# EAGLE board powerSwitch009 (EAGLE 5.12)
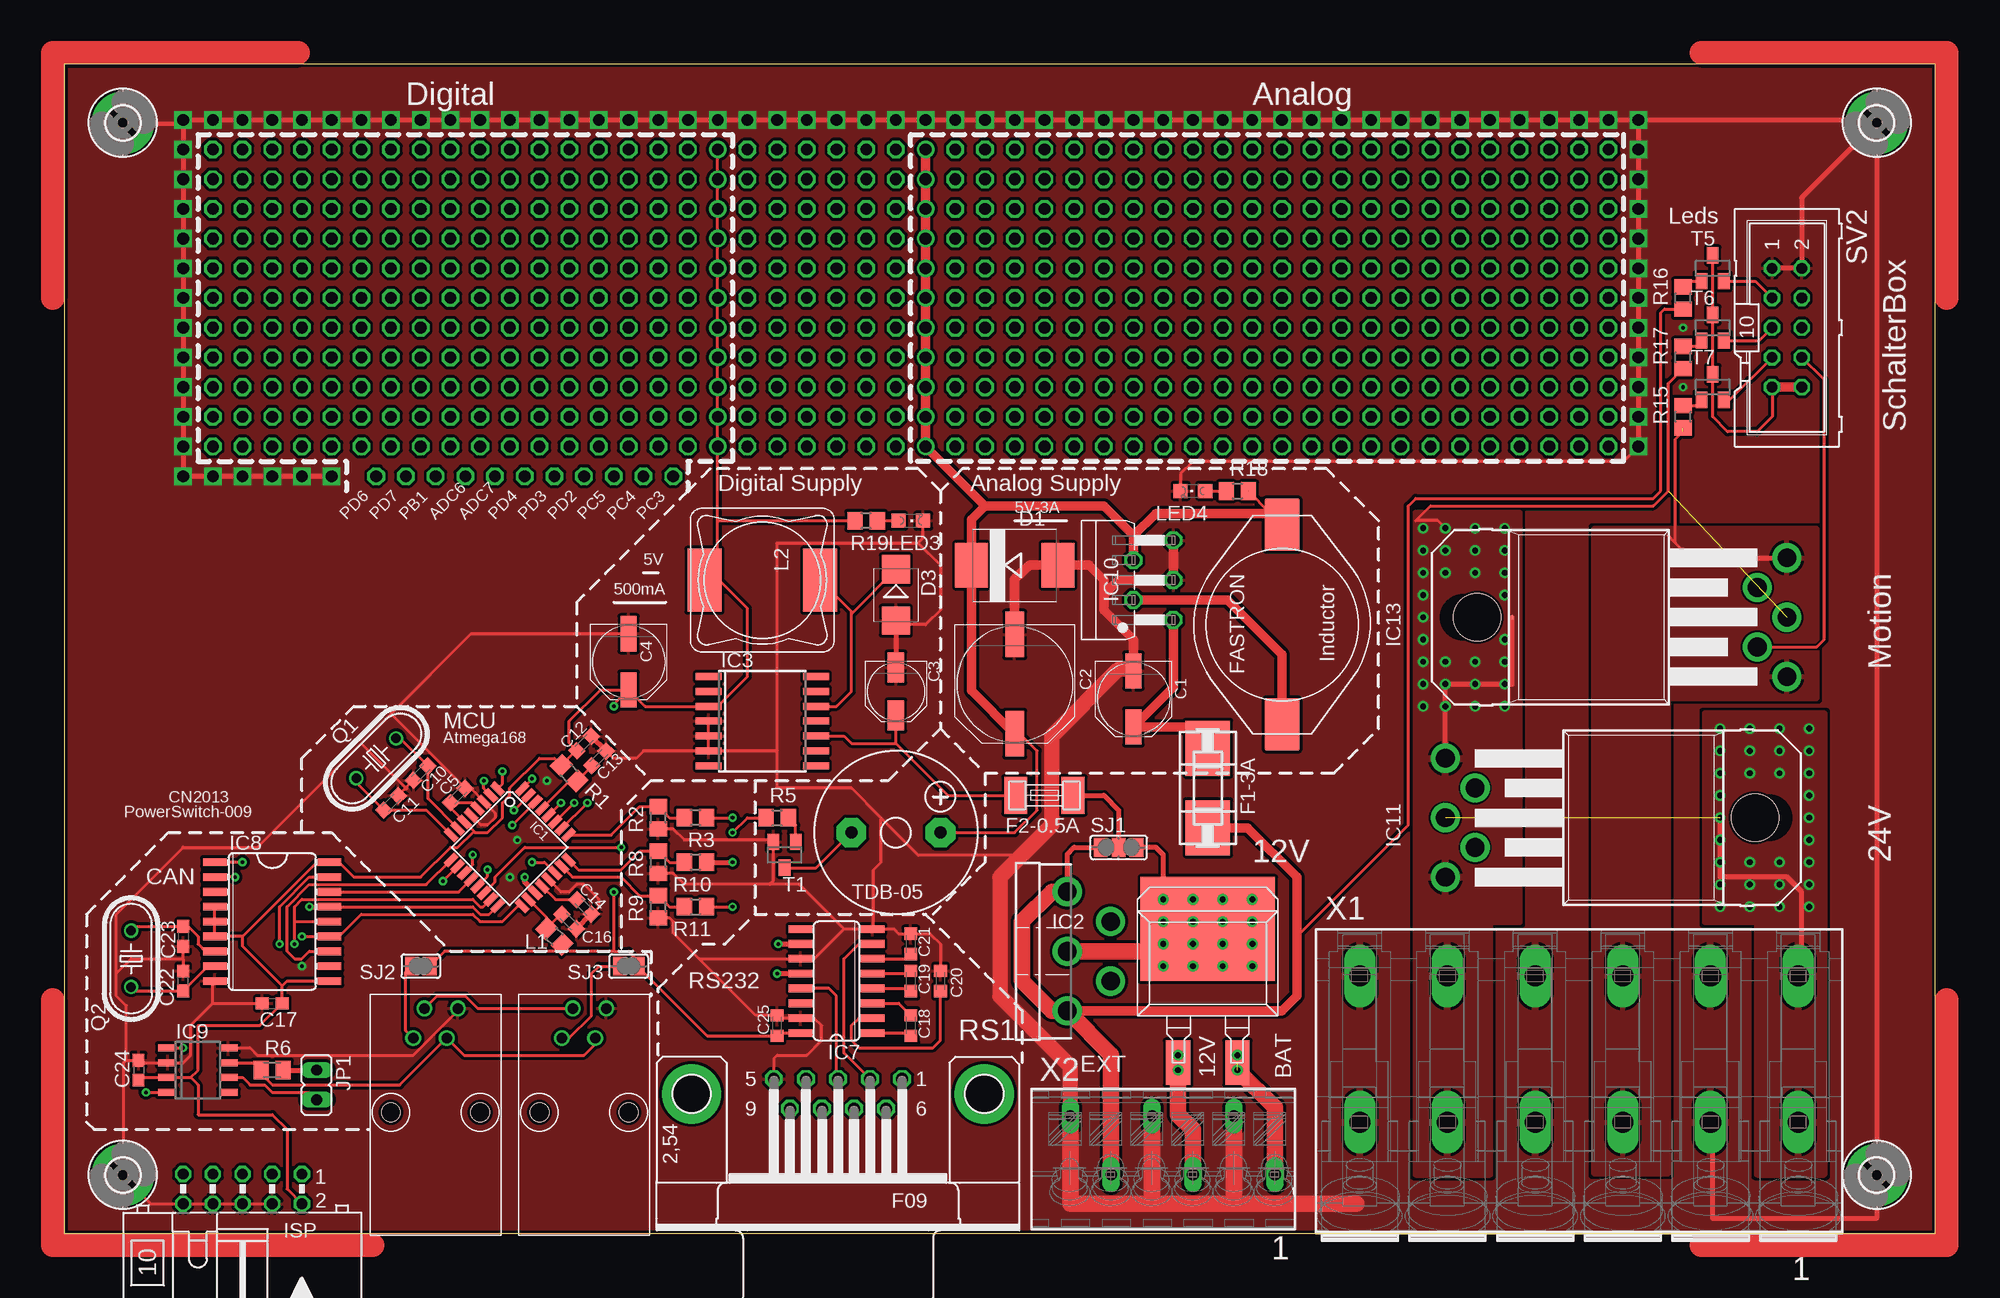
[diagram p2: board, top side]
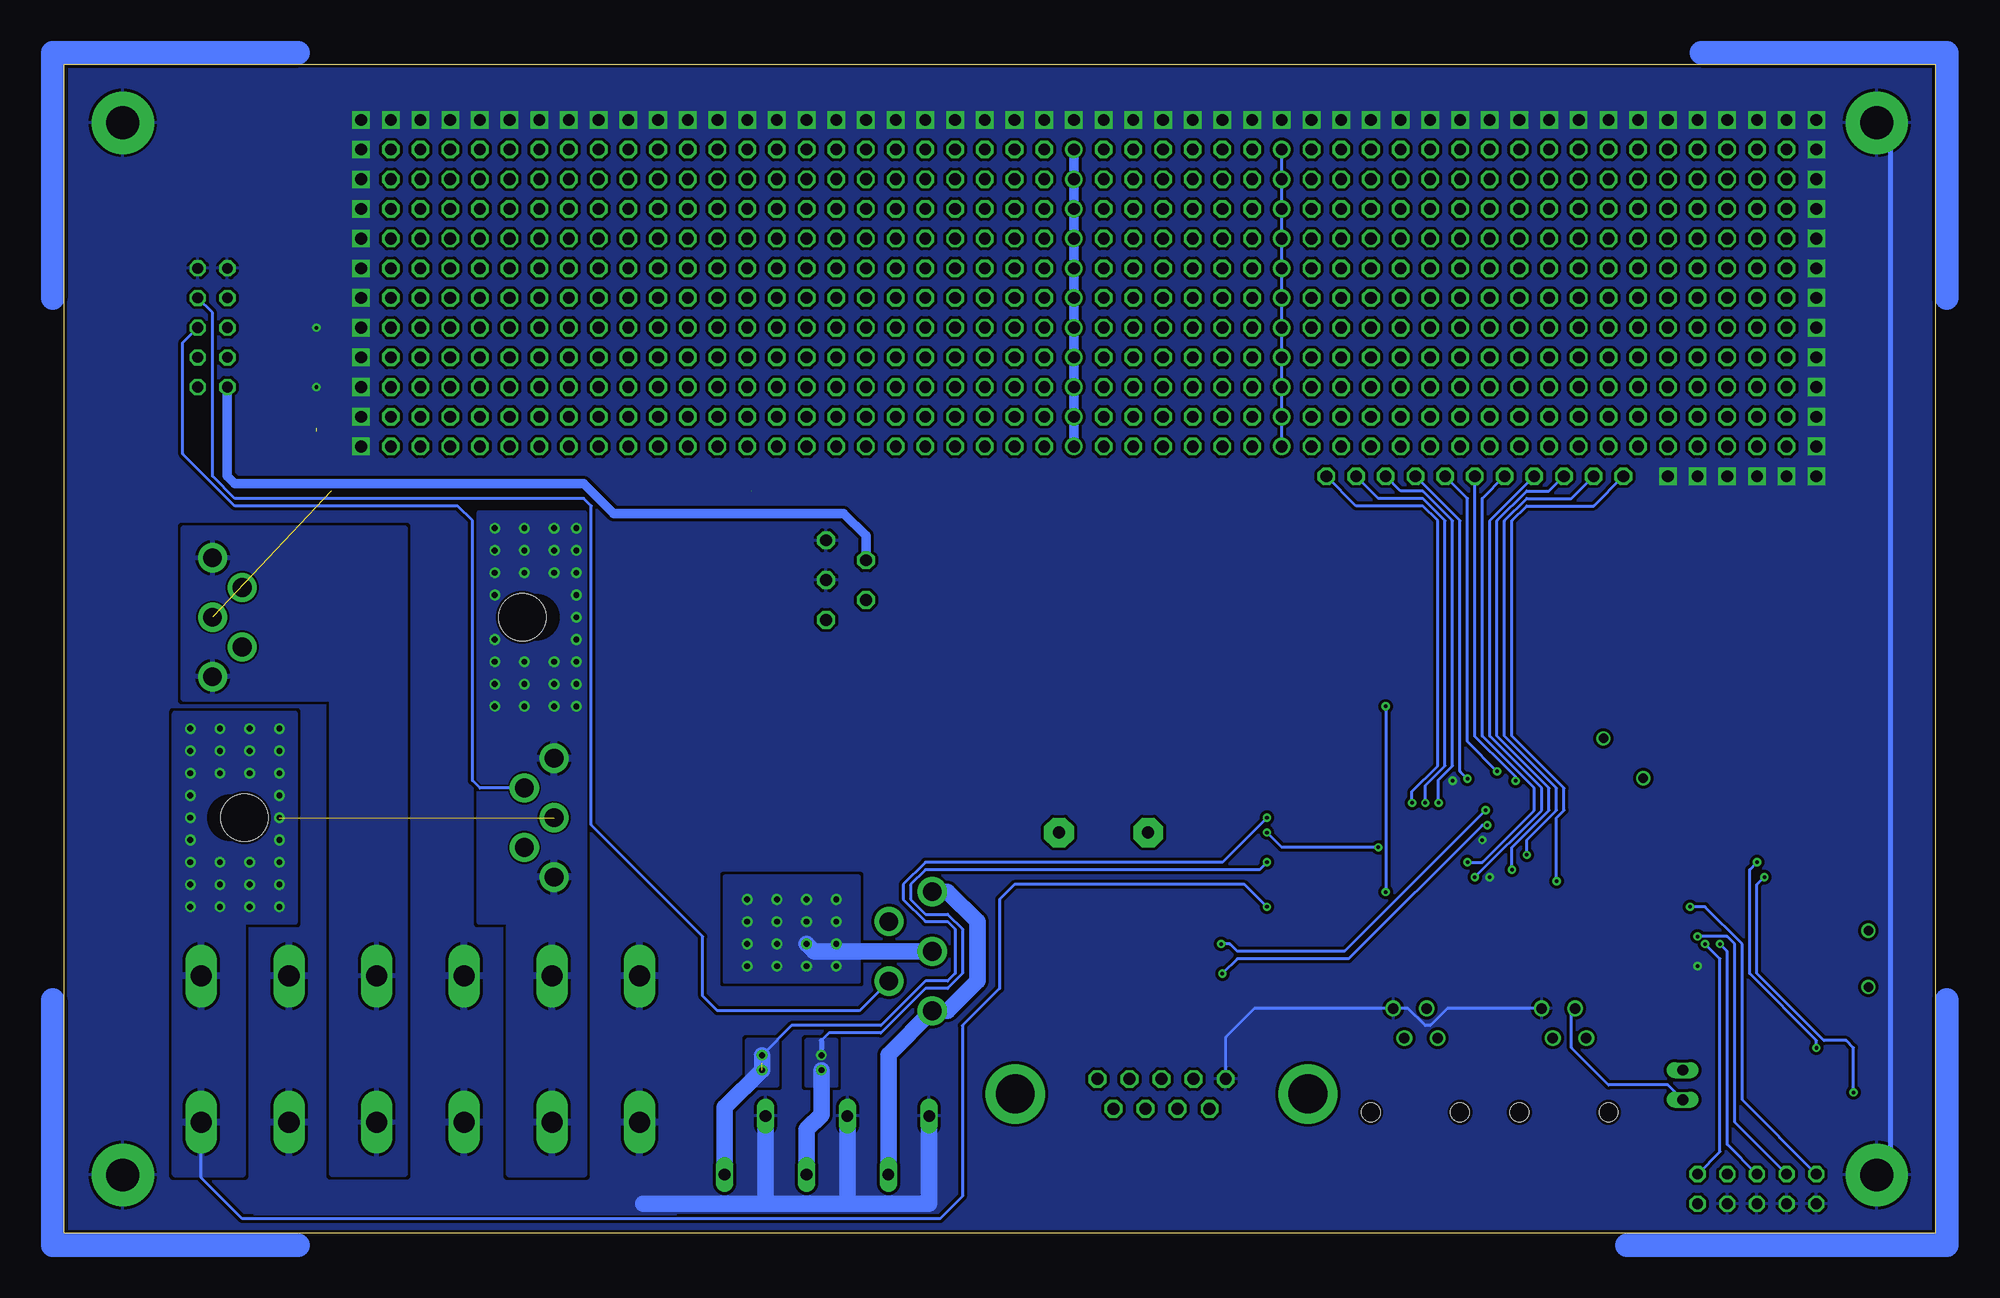
[diagram p3: board, bottom side, seen from below]

Size 160 x 100 mm. Coordinates in mm from the lower left corner, seen from the top.
Outline: 0,0 160,0 160,100 0,100 0,0
Copper layers (1+2*15+16): Top 0.035mm / dielectric 0.36mm / Route2 0.018mm / dielectric 0.71mm / Route15 0.018mm / dielectric 0.36mm / Bottom 0.035mm
Design rules "qp_designrules_6mil *": minimum track width 6mil, minimum drill 0.3mm, track to track 6mil, track to pad 6mil, pad to pad 6mil, via to via 6mil, smd to smd 6mil, copper to edge 8mil, drill to drill 10mil, minimum pad ring 8mil, minimum via ring 8mil, stop-mask expansion 4mil, vias tented up to drill 16mil, thermal gap 10mil

## Footprints (pad centres in the part's own frame; a part is rotated, then mirrored left to right if it is on the bottom)
PANASONIC_D = smd 3 x 1.4: + 2.4,0; - -2.4,0
PANASONIC_G = smd 3.9 x 1.6: + 4.25,0; - -4.25,0
PANASONIC_C = smd 2.6 x 1.4: + 2.05,0; - -2.05,0
C0603K = smd 1.05 x 1.08: 1 -0.875,0; 2 0.875,0
C0603 = smd 1.1 x 1: 1 -0.85,0; 2 0.85,0
SMC = smd 2.8 x 3.8: A 3.7,0; C -3.7,0
D2PAK = smd 2.08 x 3.81: P$1 -2.54,-6.985; P$2 2.54,-6.985 | smd 11.5 x 8.89: P$3 0,4.445
SMB = smd 2.4 x 2.4: A 2.2,0; C -2.2,0
OMNIBLOK = smd 4.7 x 3.8: P$1 -3.4,0; P$2 3.4,0
SMD-6,1X2,6 = smd 1.96 x 3.15: 1 -2.45,0; 2 2.45,0
2,8-PAD = drill 2.8 pad 5.334 round: B2,8 0,0
TQFP32-08 = smd 1.27 x 0.559: 1 -4.293,2.8; 2 -4.293,2; 3 -4.293,1.2; 4 -4.293,0.4; 5 -4.293,-0.4; 6 -4.293,-1.2; 7 -4.293,-2; 8 -4.293,-2.8; 17 4.293,-2.8; 18 4.293,-2; 19 4.293,-1.2; 20 4.293,-0.4; 21 4.293,0.4; 22 4.293,1.2; 23 4.293,2; 24 4.293,2.8 | smd 0.559 x 1.27: 9 -2.8,-4.293; 10 -2,-4.293; 11 -1.2,-4.293; 12 -0.4,-4.293; 13 0.4,-4.293; 14 1.2,-4.293; 15 2,-4.293; 16 2.8,-4.293; 25 2.8,4.293; 26 2,4.293; 27 1.2,4.293; 28 0.4,4.293; 29 -0.4,4.293; 30 -1.2,4.293; 31 -2,4.293; 32 -2.8,4.293
TO220-51 = drill 1.6 pad 2.5 round: 1 -5.1,-4.5; 2 -2.55,-8.2; 3 0,-4.5; 4 2.55,-8.2; 5 5.1,-4.5
SO14W = smd 0.6 x 2.2: 1 -3.81,-4.6; 2 -2.54,-4.6; 3 -1.27,-4.6; 4 0,-4.6; 5 1.27,-4.6; 6 2.54,-4.6; 7 3.81,-4.6; 8 3.81,4.6; 9 2.54,4.6; 10 1.27,4.6; 11 0,4.6; 12 -1.27,4.6; 13 -2.54,4.6; 14 -3.81,4.6
SO16 = smd 0.66 x 2.032: 1 -4.445,-3.073; 2 -3.175,-3.073; 3 -1.905,-3.073; 4 -0.635,-3.073; 5 0.635,-3.073; 6 1.905,-3.073; 7 3.175,-3.073; 8 4.445,-3.073; 9 4.445,3.073; 10 3.175,3.073; 11 1.905,3.073; 12 0.635,3.073; 13 -0.635,3.073; 14 -1.905,3.073; 15 -3.175,3.073; 16 -4.445,3.073
SO18L = smd 0.66 x 2.032: 1 -5.08,-4.902; 2 -3.81,-4.902; 3 -2.54,-4.902; 4 -1.27,-4.902; 5 0,-4.902; 6 1.27,-4.902; 7 2.54,-4.902; 8 3.81,-4.902; 9 5.08,-4.902; 10 5.08,4.902; 11 3.81,4.902; 12 2.54,4.902; 13 1.27,4.902; 14 0,4.902; 15 -1.27,4.902; 16 -2.54,4.902; 17 -3.81,4.902; 18 -5.08,4.902
SO8 = smd 0.6 x 1.6: 1 -1.905,-2.6; 2 -0.635,-2.6; 3 0.635,-2.6; 4 1.905,-2.6; 5 1.905,2.6; 6 0.635,2.6; 7 -0.635,2.6; 8 -1.905,2.6
TO220-5_STAGGERED = drill 1.016 octagon: !EN 3.404,-3.404; FB 1.702,0; GND 0,-3.404; IN -3.404,-3.404; OUT -1.702,0
TO220-52 = drill 1.6 pad 2.5 round: 1 -5.08,-30.48; 2 -2.54,-27.94; 3 0,-30.48; 4 2.54,-27.94; 5 5.08,-30.48 | smd 0.305 x 0.152: 6 0,-6.985 | hole 4.05: 0,-4
ML10L = drill 0.914 octagon: 1 -5.08,-1.27; 2 -5.08,1.27; 3 -2.54,-1.27; 4 -2.54,1.27; 5 0,-1.27; 6 0,1.27; 7 2.54,-1.27; 8 2.54,1.27; 9 5.08,-1.27; 10 5.08,1.27
JP1 = drill 0.914 long: 1 0,-1.27; 2 0,1.27
R0805 = smd 1.3 x 1.5: 1 -0.95,0; 2 0.95,0
PIS4728 = smd 5.4 x 2.9: P$1 0,4.95; P$2 0,-4.95
PISR = smd 4.5 x 3: P$1 -8.55,0; P$2 8.55,0
CHIPLED_0805 = smd 1.2 x 1.2: A 0,-1.05; C 0,1.05
HC49U-V = drill 0.813 round: 1 -2.413,0; 2 2.413,0
M0805 = smd 1.3 x 1.6: 1 -0.95,0; 2 0.95,0
RJ10 = drill 0.9 round: P$1 -1.905,6.55; P$2 -0.953,9.09; P$3 0.953,6.55; P$4 1.905,9.09 | hole 1.59: -3.81,0.2; 3.81,0.2
F09HP = drill 1.016 octagon: 1 -5.486,-1.27; 2 -2.743,-1.27; 3 0,-1.27; 4 2.743,-1.27; 5 5.486,-1.27; 6 -4.115,1.27; 7 -1.372,1.27; 8 1.372,1.27; 9 4.115,1.27 | drill 3.302 pad 5.08 round: G1 -12.522,0; G2 12.522,0
SJ_2 = smd 1.168 x 1.6: 1 -1.524,0; 2 0,0; 3 1.524,0
SJ = smd 1.168 x 1.6: 1 -0.762,0; 2 0.762,0
ML10 = drill 0.914 octagon: 1 -5.08,-1.27; 2 -5.08,1.27; 3 -2.54,-1.27; 4 -2.54,1.27; 5 0,-1.27; 6 0,1.27; 7 2.54,-1.27; 8 2.54,1.27; 9 5.08,-1.27; 10 5.08,1.27
SOT23 = smd 1 x 1.4: 1 -0.95,-1.1; 2 0.95,-1.1; 3 0,1.1
F/CM12P = drill 1.016 pad 2.54 octagon: + 3.81,0; - -3.81,0
P-2706-106 = drill 1.8 long: L1.1 3.185,18.75; L1.2 -9.315,18.75; L2.1 3.185,11.25; L2.2 -9.315,11.25; L3.1 3.185,3.75; L3.2 -9.315,3.75; L4.1 3.185,-3.75; L4.2 -9.315,-3.75; L5.1 3.185,-11.25; L5.2 -9.315,-11.25; L6.1 3.185,-18.75; L6.2 -9.315,-18.75
P-250-206 = drill 1 long: L1 1.3,9.55; L2 -3.7,6.05; L3 1.3,2.55; L4 -3.7,-0.95; L5 1.3,-4.45; L6 -3.7,-7.95

## Placement (x,y rotation side)
C1  100 µF  [PANASONIC_D]  91.44,45.72 270 top
C2  1000 µF  [PANASONIC_G]  81.28,46.99 270 top
C3  VF 22/35 P-C  [PANASONIC_C]  71.12,46.35 270 top
C4  VF 220/16 K-D8  [PANASONIC_D]  48.26,48.9 270 top
C5  100n  [C0603K]  33.66,37.47 45 top
C10  22p  [C0603K]  30.48,39.37 45 top
C11  22p  [C0603K]  27.94,36.83 225 top
C12  100n  [C0603K]  44.45,41.91 225 top
C13  100n  [C0603K]  45.72,40.64 225 top
C14  100n  [C0603K]  44.45,27.94 135 top
C16  100n  [C0603K]  43.18,26.67 315 top
C17  100n  [C0603]  17.78,19.68 0 top
C18  100n  [C0603K]  72.39,17.78 270 top
C19  100n  [C0603K]  72.39,21.59 270 top
C20  100n  [C0603K]  74.93,21.59 90 top
C21  100n  [C0603K]  72.39,24.77 90 top
C22  22p  [C0603]  10.16,21.59 90 top
C23  22p  [C0603]  10.16,25.4 270 top
C24  100n  [C0603]  6.35,13.97 270 top
C25  100n  [C0603K]  60.96,17.78 90 top
D1  MBRS360  [SMC]  81.28,57.15 0 top
D2  SFS1602G  [D2PAK]  97.79,21.59 0 top
D3  MBRS140  [SMB]  71.12,54.61 270 top
F1-3A  SMD-MICRO-FUSE-BLOCK  [OMNIBLOK]  97.79,38.1 90 top
F2-0.5A  SMD-MICRO-FUSE  [SMD-6,1X2,6]  83.82,37.47 180 top
H5  MOUNT-PAD-ROUND2.8  [2,8-PAD]  5,95 0 top
H6  MOUNT-PAD-ROUND2.8  [2,8-PAD]  155,95 0 top
H7  MOUNT-PAD-ROUND2.8  [2,8-PAD]  5,5 0 top
H8  MOUNT-PAD-ROUND2.8  [2,8-PAD]  155,5 0 top
IC1  MEGA168  [TQFP32-08]  38.1,33.02 315 top
IC2  BTS555  [TO220-51]  81.28,24.13 90 top
IC3  LM2574M-5.0  [SO14W]  59.69,43.81 270 top
IC7  MAX202  [SO16]  66.04,21.59 90 top
IC8  MCP2515-E/SO  [SO18L]  17.78,26.67 270 top
IC9  PCA82C250T  [SO8]  11.43,13.97 270 top
IC10  LM2576-5  [TO220-5_STAGGERED]  91.44,55.88 90 top
IC11  BTS555E3146  [TO220-52]  148.59,35.56 270 top
IC13  BTS555E3146  [TO220-52]  116.84,52.7 90 top
ISP  socket  [ML10L]  15.24,3.81 180 top
JP1  [JP1]  21.59,12.7 180 top
L1  10µH  [R0805]  41.91,25.4 315 top
L2  L-PIS4728  [PIS4728]  59.69,55.88 270 top
L-PISR  100 µH  [PISR]  104.14,52.07 90 top
LED3  [CHIPLED_0805]  72.39,60.96 270 top
LED4  [CHIPLED_0805]  96.52,63.5 90 top
Q1  20Mhz  [HC49U-V]  26.67,40.64 45 top
Q2  16MHz  [HC49U-V]  5.71,23.5 270 top
R1  10k  [R0805]  43.18,39.37 135 top
R2  20k  [R0805]  50.8,35.56 90 top
R3  100k  [R0805]  53.98,35.56 180 top
R5  4k7  [R0805]  60.96,35.56 0 top
R6  [M0805]  17.78,13.97 0 top
R8  20k  [R0805]  50.8,31.75 90 top
R9  20k  [R0805]  50.8,27.94 90 top
R10  100k  [R0805]  53.98,31.75 180 top
R11  100k  [R0805]  53.98,27.94 0 top
R15  20k  [R0805]  138.43,69.85 90 top
R16  10k  [R0805]  138.43,80.01 90 top
R17  20k  [R0805]  138.43,74.93 90 top
R18  150  [R0805]  100.33,63.5 0 top
R19  150  [R0805]  68.58,60.96 180 top
RJ_1  RJ10  [RJ10]  44.45,10.16 0 top
RJ_2  RJ10  [RJ10]  31.75,10.16 0 top
RS1  socket  [F09HP]  66.17,11.94 180 top
SJ1  [SJ_2]  90.17,33.02 0 top
SJ2  [SJ]  30.48,22.86 180 top
SJ3  [SJ]  48.26,22.86 180 top
SV2  SchalterBox  [ML10]  147.32,77.47 270 top
T1  BC847  [SOT23]  61.59,32.38 180 top
T5  BC849  [SOT23]  140.97,82.55 0 top
T6  BC849  [SOT23]  140.97,77.47 0 top
T7  BC849  [SOT23]  140.97,72.39 0 top
TDB-05  F/CM12P  [F/CM12P]  71.12,34.29 0 top
X1  2706-106  [P-2706-106]  129.54,12.7 270 top
X2  250-206  [P-250-206]  93.98,6.35 270 top

## Tracks (layer width: path | path; a pad name or v marks a point on that pad's centre or on a via)
+5V  (via drill 1)  (1 unrouted)
  Top 0.254: SV2.9 146.05,69.85 144.78,68.58 142.24,68.58 140.97,69.85 T7.3 T6.3 T5.3 | TDB-05.+ 81.28,34.29 83.19,36.2 83.19,41.27 81.72,42.74 C2.+ | 103.17,61.59 101.26,63.5
  Top 0.813: SV2.9 SV2.10 | 91.44,59.69 93.34,61.59 103.17,61.59 L-PISR.P$2 | 78.74,62.23 v73.66,67.31 v73.66,69.85 v73.66,72.39 v73.66,74.93 v73.66,77.47 v73.66,80.01 v73.66,82.55 v73.66,85.09 v73.66,87.63 v73.66,90.17 v73.66,92.71 | 91.44,59.69 IC10.FB | 91.44,59.69 88.9,62.23 78.74,62.23 | 78.74,62.23 77.58,61.07 D1.C 77.58,46.44 C2.+
  Bottom 0.813: IC10.FB 91.44,59.69 93.34,61.59 113.03,61.59 115.57,64.14 145.41,64.14 146.05,64.77 SV2.9 | v73.66,67.31 v73.66,69.85 v73.66,72.39 v73.66,74.93 v73.66,77.47 v73.66,80.01 v73.66,82.55 v73.66,85.09 v73.66,87.63 v73.66,90.17 v73.66,92.71
ADC0
  Top 0.254: R11.1 51.75,27.94 R9.2 49.22,28.89 47.62,30.48 43.47,30.48 IC1.23
ADC1
  Top 0.254: R10.2 51.75,31.75 R8.2 49.21,32.7 47.62,31.11 43.97,31.11 IC1.24
ADC2
  Top 0.254: R3.2 51.75,35.56 R2.2 49.21,36.51 46.77,34.08 IC1.25
ADC6  (via drill 0.3, 1)
  Top 0.406: IC1.19 39.37,30.05 v39.37,30.48
  Bottom 0.254: v39.37,30.48 33.66,36.2 33.66,38.1 38.1,42.55 38.1,60.96 v34.29,64.77
ADC7  (via drill 0.3, 1)
  Top 0.254: IC1.22 41.07,31.75 v40.01,31.75
  Bottom 0.254: v40.01,31.75 38.73,31.75 34.29,36.2 34.29,38.1 38.73,42.55 38.73,62.87 v36.83,64.77
BAT12V  (via drill 0.3, 0.5)  (1 unrouted)
  Top 0.254: R3.1 v57.15,35.56
  Top 1.422: X2.L1 103.53,10.77 v100.33,13.97 v100.33,15.24
  Bottom 0.254: v100.33,15.24 97.79,17.78 90.17,17.78 86.36,21.59 84.45,21.59 83.82,22.23 83.82,26.04 84.45,26.67 86.36,26.67 88.27,28.57 88.27,29.84 86.36,31.75 60.96,31.75 v57.15,35.56
  Bottom 1.422: v100.33,15.24 v100.33,13.97 103.53,10.77 X2.L1
  pour Bottom: 99.06,16.51 101.6,16.51 101.6,12.7 99.06,12.7
BAT24V  (via drill 0.3, 0.5)  (1 unrouted)
  Top 0.254: R11.2 v57.15,27.94
  Top 0.406: X1.L1.2 148.59,22.32 148.59,29.21 147.32,30.48 141.6,30.48 IC11.6
  Bottom 0.254: v57.15,27.94 59.05,29.84 78.74,29.84 80.01,28.57 80.01,20.95 83.19,17.78 83.19,3.17 85.09,1.27 144.78,1.27 148.29,4.78 X1.L1.1
  other vias: 149.22,41.27 149.22,39.37 149.22,37.47 149.22,35.56 149.22,43.18 146.69,43.18 144.15,43.18 141.6,43.18 146.69,39.37 149.22,31.75 149.22,27.94 146.69,27.94 144.15,27.94 141.6,27.94 141.6,31.75 141.6,35.56 141.6,39.37 144.15,39.37 141.6,41.27 144.15,41.27 146.69,41.27 146.69,29.84 144.15,29.84 141.6,29.84 144.15,31.75 146.69,31.75 149.22,29.84 149.22,33.66 141.6,33.66 141.6,37.47
  pour Top: 150.5,44.45 140.34,44.45 140.34,26.67 144.78,26.67 144.78,5.08 150.5,5.08
  pour Bottom: 150.5,44.45 140.34,44.45 140.34,26.67 144.78,26.67 144.78,5.08 150.5,5.08
CANH
  Top 0.254: IC9.7 16.2,14.61 R6.1 | RJ_1.P$3 45.4,16.19 44.45,15.24 34.17,15.24 RJ_2.P$3 28.69,12.7 17.78,12.7 16.83,13.65
  Top 0.406: R6.1 16.83,13.65
CANL
  Top 0.254: RJ_1.P$2 35.36,19.25 34.29,20.32 31.87,20.32 RJ_2.P$2 | JP1.2 20.95,12.06 17.78,12.06 17.14,12.7 15.88,12.7 15.24,13.34 IC9.6
  Bottom 0.254: JP1.2 22.86,12.7 27.94,12.7 31.11,15.88 31.11,18.93 RJ_2.P$2
CS
  Top 0.254: IC8.16 33.72,29.21 IC1.12
EXT  (via drill 0.3, 0.5)
  Top 0.406: R10.1 v57.15,31.75
  Top 1.422: X2.L3 96.53,8.9 95.25,10.16 v95.25,13.97 D2.P$1
  Bottom 0.254: v57.15,31.75 57.78,31.11 86.36,31.11 87.63,29.84 87.63,28.57 86.36,27.3 84.45,27.3 83.19,26.04 83.19,22.23 84.45,20.95 86.36,20.95 90.17,17.14 94.61,17.14 95.25,16.51
  Bottom 0.406: 95.25,16.51 v95.25,15.24
  Bottom 1.422: v95.25,13.97 95.25,10.16 96.53,8.9 X2.L3
  pour Bottom: 93.98,16.51 96.52,16.51 96.52,12.7 93.98,12.7
GND  (via drill 0.3, 1)
  Top 0.254: 6.57,14.61 IC9.2 10.16,14.61 10.79,15.24 10.79,17.78 12.7,19.68 | ISP.4 ISP.6 ISP.8 ISP.10 7.41,2.54 H7.B2,8 | 29.21,38.1 C11.1 | 29.21,38.1 C10.1 | 61.2,18.41 IC7.15 64.14,18.41 64.77,17.78 64.77,16.51 63.5,15.24 60.96,15.24 60.68,14.96 RS1.5 | C20.2 74.93,24.77 74.06,25.64 C21.2 71.36,25.64 70.97,26.04 69.22,26.04 69.22,31.11 69.85,31.75 69.85,35.56 | IC3.4 IC3.5 IC3.6 | 66.67,26.04 64.14,23.5 IC7.11 54.3,23.5 | 66.67,26.04 IC7.8 | 34.73,38.08 IC1.3 36.83,35.99 36.83,35.56 36.2,34.92 35.63,34.92 IC1.5 | 10.16,23.5 C22.2 | 10.16,23.5 C23.2 | 4.45,22.23 4.45,20.32 5.29,19.47 5.29,14.82 | 4.45,22.23 5.71,23.5 10.16,23.5 | RJ_2.P$4 33.66,19.05 29.84,15.24 16.51,15.24 15.88,15.88 IC9.8 | 27.94,44.45 34.78,51.3 C4.- | 60.33,29.84 62.87,29.84 66.67,26.04 | 60.33,29.84 53.02,29.84 52.07,30.8 R8.1 | 60.33,29.84 60.65,30.16 T1.2 60.18,33.66 53.02,33.66 52.07,34.61 R2.1 | 69.85,35.56 67.31,38.1 60.96,38.1 60.96,41.27 | 60.96,41.27 60.96,59.05 73.03,59.05 | IC8.9 12.88,21.41 | 27.94,44.45 34.29,38.1 | 71.46,52.07 73.66,52.07 74.93,53.34 74.93,57.15 73.03,59.05 | R9.1 51.75,26.99 52.07,26.67 52.07,25.72 54.3,23.5 | H7.B2,8 5,5.16 | 5.29,14.82 C24.1 | 5.29,14.82 5.08,14.61 5.08,5.08 H7.B2,8 | 12.7,19.68 C17.1 | 12.7,19.68 12.7,21.41 | IC3.6 49.53,41.27 48.9,40.64 46.96,40.64 C13.1 | IC1.21 42.48,29.21 43.18,29.21 43.81,29.84 44.45,29.84 45.72,28.57 45.72,27.94 45.1,27.32 | 25.4,41.91 16.51,33.02 10.16,33.02 4.45,27.3 4.45,22.23 | 25.4,41.91 27.94,44.45 | 25.4,41.91 29.21,38.1 | v134.62,67.31 133.35,66.04 96.52,66.04 95.47,64.99 LED4.C | 81.92,32.38 73.03,32.38 69.85,35.56 | 60.96,41.27 IC3.6 | 54.3,23.5 59.13,18.66 C25.2
  Top 0.254: LED3.C 73.44,59.47 73.03,59.05
  Top 0.406: C24.1 6.57,14.61 | SV2.1 SV2.2 148.59,88.59 H6.B2,8 | 86,7.62 86,10 | H5.B2,8 10.16,94.94 | 61.2,18.41 C25.2 | 10.16,94.94 v10.16,92.71 v10.16,90.17 v10.16,87.63 v10.16,85.09 v10.16,82.55 v10.16,80.01 v10.16,77.47 v10.16,74.93 v10.16,72.39 v10.16,69.85 v10.16,67.31 v10.16,64.77 v12.7,64.77 v15.24,64.77 v17.78,64.77 v20.32,64.77 v22.86,64.77 | 10.16,94.94 v10.16,95.25 v12.7,95.25 v15.24,95.25 v17.78,95.25 v20.32,95.25 v22.86,95.25 v25.4,95.25 v27.94,95.25 v30.48,95.25 v33.02,95.25 v35.56,95.25 v38.1,95.25 v40.64,95.25 v43.18,95.25 v45.72,95.25 v48.26,95.25 v50.8,95.25 v53.34,95.25 v55.88,95.25 v58.42,95.25 v60.96,95.25 v63.5,95.25 v66.04,95.25 v68.58,95.25 v71.12,95.25 v73.66,95.25 v76.2,95.25 v78.74,95.25 v81.28,95.25 v83.82,95.25 v86.36,95.25 v88.9,95.25 v91.44,95.25 v93.98,95.25 v96.52,95.25 v99.06,95.25 v101.6,95.25 v104.14,95.25 v106.68,95.25 v109.22,95.25 v111.76,95.25 v114.3,95.25 v116.84,95.25 v119.38,95.25 v121.92,95.25 v124.46,95.25 v127,95.25 v129.54,95.25 v132.08,95.25 v134.62,95.25 | C21.2 72.63,25.4 | 34.73,38.08 C5.2 34.29,38.1 | H6.B2,8 H8.B2,8 155,1.33 154.94,1.27 140.97,1.27 140.97,9.34 X1.L2.1 | C3.- D3.A 71.46,52.07 | H6.B2,8 154.75,95.25 v134.62,95.25 | 91.3,48.26 C1.- | 12.7,21.41 IC8.9 | C16.2 C14.1 45.1,27.32 | IC7.8 69.22,26.04 | C13.1 C12.1 | v134.62,95.25 v134.62,92.71 v134.62,90.17 v134.62,87.63 v134.62,85.09 v134.62,82.55 v134.62,80.01 v134.62,77.47 v134.62,74.93 v134.62,72.39 v134.62,69.85 v134.62,67.31 | 29.21,38.1
  Top 0.813: IC10.!EN IC10.GND 90.17,55.88 88.9,54.61 | C1.- 91.44,50.8 88.9,53.34 88.9,54.61 | C2.- 81.28,55.99 82.55,57.15 D1.A 87.63,57.15 88.9,55.88 88.9,54.61
  Top 1.27: 91.3,48.26 90.17,48.26 84.45,42.55 84.45,34.92 81.92,32.38 80.01,30.48 80.01,20.32 86,14.33 86,7.62
  Top 1.422: X2.L4 93.03,2.54 | 93.03,2.54 100.03,2.54 | X2.L2 100.03,2.54 | 100.03,2.54 110.49,2.54 | X2.L6 86.03,2.54 93.03,2.54
  Bottom 0.254: RJ_2.P$4 41.71,19.25 43.18,17.78 43.62,17.78 45.09,19.25 RJ_1.P$4 58.22,19.25 60.68,16.79 RS1.5
  Bottom 0.406: H5.B2,8 3.81,93.81 3.81,6.19 H7.B2,8
  Bottom 1.422: X2.L6 86.03,2.54 93.03,2.54 | 93.03,2.54 100.03,2.54 | 100.03,2.54 110.49,2.54 | 93.03,2.54 X2.L4 | 100.03,2.54 X2.L2
  other vias: 20.32,22.86 38.73,33.66 38.1,30.48 41.27,38.73 138.43,72.39 138.43,77.47
  pour Bottom: 107.95,25.4 107.95,1.27 143.51,1.27 143.51,25.4 138.43,25.4 138.43,3.81 128.27,3.81 128.27,25.4 123.19,25.4 123.19,3.81 113.03,3.81 113.03,25.4
  pour Top (isolate 0.61): 107.95,25.4 107.95,1.27 143.51,1.27 143.51,25.4 138.43,25.4 138.43,3.81 128.27,3.81 128.27,25.4 123.19,25.4 123.19,3.81 113.03,3.81 113.03,25.4
  pour Bottom (isolate 0.254, rank 2): 0,100 0,0 160,0 160,100
  pour Top (isolate 0.254, rank 2): 0,100 0,0 160,0 160,100
INT
  Top 0.254: IC1.9 30.96,29.84 20.95,29.84 19.05,27.94 19.05,24.13 19.68,23.5 20.32,23.5 20.95,24.13 IC8.12
LED_GELB
  Top 0.254: SV2.5 144.95,76.37 T6.2
LED_GRUEN
  Top 0.254: T7.2 142.41,71.29 SV2.7
LED_ROT
  Top 0.254: SV2.3 144.61,81.45 T5.2
MISO  (via drill 0.3)
  Top 0.254: IC1.16 36.34,27.3 35.56,27.3 34.92,27.94 IC8.15
  Top 0.406: v20.95,27.94 IC8.15
  Bottom 0.254: ISP.9 16.51,11.43 16.51,24.77 19.68,27.94 v20.95,27.94
MOSI  (via drill 0.3)
  Top 0.254: v19.68,24.77 19.68,26.67 | 19.68,26.67 IC8.14 | IC1.15 35.84,27.94 35.56,27.94 34.92,28.57 20.32,28.57 19.68,27.94 19.68,26.67
  Bottom 0.254: ISP.1 18.41,6.99 18.41,23.5 v19.68,24.77
MOTION24V  (1 unrouted)
  Top 0.254: 138.43,58.42 137.79,59.05 | 137.79,59.05 137.16,59.69 | 137.79,59.05 137.79,67.94 138.43,68.58
  Top 0.406: 138.43,58.42 139.06,57.78 IC13.5
  pour Top: 149.86,60.33 149.86,45.72 137.16,45.72 137.16,5.08 130.81,5.08 130.81,60.33
  pour Bottom: 149.86,60.33 149.86,45.72 137.16,45.72 137.16,5.08 130.81,5.08 130.81,60.33
N$1
  Top 0.254: R5.2 62.55,34.92 T1.1
N$2
  Top 0.254: SJ3.2 45.72,22.86 45.09,22.23 45.09,18.61 43.18,16.71 RJ_1.P$1
N$3  (via drill 1)
  other vias: 101.6,92.71
N$4
  Top 0.254: RJ_2.P$1 29.21,17.34 29.21,22.35 SJ2.2
N$5  (via drill 1)
  other vias: 63.5,90.17
N$6  (via drill 1)
  other vias: 58.42,92.71
N$7
  Top 0.406: R6.2 JP1.1
N$9
  Top 0.813: L-PISR.P$1 104.14,49.53 99.49,54.18 IC10.OUT
N$10
  Top 0.254: IC1.7 31.1,37.19 C10.2 28.74,42.35 Q1.2
N$11
  Top 0.254: IC1.8 30.95,36.21 C11.2 24.96,38.57 Q1.1
N$12  (via drill 1)
  other vias: 58.42,90.17
N$13
  Top 0.254: C14.2 41.99,28.56 IC1.20
N$14
  Top 0.254: IC1.18 41.24,27.05 L1.1 42.45,27.29
  Top 0.406: C16.1 42.45,27.29
N$15
  Top 0.254: IC7.1 72.15,17.14
  Top 0.406: 72.15,17.14 C18.2
N$17  (via drill 1)
  other vias: 58.42,87.63
N$18
  Top 0.254: IC7.4 72.15,20.95
  Top 0.406: 72.15,20.95 C19.2
N$19
  Top 0.813: F1-3A.P$2 95.97,43.32 C1.+ 94.84,46.72 IC10.IN
N$20
  Top 0.254: T1.3 64.31,31.29 TDB-05.-
N$21  (via drill 1)
  other vias: 58.42,85.09
N$22
  Top 0.254: F2-0.5A.2 75.56,37.47 71.12,41.91 | 71.12,41.91 C3.+ | 71.12,41.91 67.31,41.91 66.67,42.55 IC3.10
N$23
  Top 2: 26.35,-1 20,-1 -1,-1 -1,20
N$24  (via drill 1)
  other vias: 58.42,82.55
N$25
  Top 2: 140,-1 161,-1 161,20
N$26
  Top 2: 20,101 -1,101 -1,80
N$27
  Top 2: 161,80 161,101 140,101
N$28
  Bottom 2: 26.35,-1 20,-1 -1,-1 -1,20
N$29
  Bottom 2: 140,-1 161,-1 161,20
N$30
  Bottom 2: 20,101 -1,101 -1,80
N$31  (via drill 1)
  other vias: 63.5,82.55
N$32
  Top 0.254: Q2.2 6.06,20.74 C22.1 12.28,22.86
  Top 0.406: 12.28,22.86 IC8.8
N$33  (via drill 1)
  other vias: 63.5,85.09
N$34
  Top 0.254: Q2.1 6.06,26.25 C23.1 10.58,26.25 11.43,25.4 11.43,24.77 12.06,24.13
  Top 0.406: 12.06,24.13 IC8.7
N$35
  Top 0.254: IC7.3 71.36,19.68 C18.1
N$36
  Top 0.254: IC7.5 72.15,22.23
  Top 0.406: 72.15,22.23 C19.1
N$37
  Top 0.254: IC7.2 67.94,18.41 67.31,17.78 67.31,16.51 67.94,15.88 74.3,15.88 74.93,16.51 C20.1
N$38
  Top 0.254: IC7.6 72,23.5 C21.1
N$39
  Bottom 2: 161,80 161,101 140,101
N$40
  Top 0.254: IC7.13 65.41,20.95 66.04,20.32 66.04,13.34 RS1.3
N$41
  Top 0.254: IC7.7 67.94,24.77 66.67,23.5 66.67,15.44 RS1.2
N$42  (via drill 1)
  other vias: 60.96,87.63
N$43  (via drill 1)
  other vias: 60.96,90.17
N$44  (via drill 1)
  other vias: 60.96,92.71
N$45  (via drill 1)
  other vias: 66.04,92.71
N$46  (via drill 1)
  other vias: 68.58,92.71
N$47  (via drill 1)
  other vias: 66.04,90.17
N$48  (via drill 1)
  other vias: 68.58,90.17
N$49  (via drill 1)
  other vias: 66.04,87.63
N$50  (via drill 1)
  other vias: 68.58,87.63
N$51  (via drill 1)
  other vias: 66.04,85.09
N$52  (via drill 1)
  other vias: 68.58,85.09
N$53  (via drill 1)
  other vias: 66.04,82.55
N$54  (via drill 1)
  other vias: 68.58,82.55
N$55  (via drill 1)
  other vias: 71.12,82.55
N$56  (via drill 1)
  other vias: 71.12,85.09
N$57  (via drill 1)
  other vias: 71.12,87.63
N$58  (via drill 1)
  other vias: 71.12,90.17
N$59  (via drill 1)
  other vias: 71.12,92.71
N$63
  Top 0.406: SJ1.2 90.17,36.2 88.9,37.47 F2-0.5A.1
N$64
  Top 0.254: L2.P$1 67.31,53.21 67.31,53 | 67.31,53 67.31,46.35 66.04,45.09 IC3.12 | 67.31,53 D3.C
  Top 0.406: D3.C 70.91,56.81
N$65  (via drill 1)
  other vias: 83.82,90.17
N$66  (via drill 1)
  other vias: 78.74,92.71
N$67  (via drill 1)
  other vias: 76.2,90.17
N$68  (via drill 1)
  other vias: 78.74,90.17
N$69  (via drill 1)
  other vias: 76.2,87.63
N$70  (via drill 1)
  other vias: 78.74,87.63
N$71  (via drill 1)
  other vias: 76.2,85.09
N$72  (via drill 1)
  other vias: 78.74,85.09
N$73  (via drill 1)
  other vias: 76.2,82.55
N$74  (via drill 1)
  other vias: 78.74,82.55
N$75  (via drill 1)
  other vias: 83.82,92.71
N$76  (via drill 1)
  other vias: 83.82,85.09
N$77  (via drill 1)
  other vias: 81.28,87.63
N$78  (via drill 1)
  other vias: 81.28,90.17
N$79  (via drill 1)
  other vias: 81.28,92.71
N$80  (via drill 1)
  other vias: 86.36,92.71
N$81  (via drill 1)
  other vias: 88.9,92.71
N$82  (via drill 1)
  other vias: 86.36,90.17
N$83  (via drill 1)
  other vias: 88.9,90.17
N$84  (via drill 1)
  other vias: 86.36,87.63
N$85  (via drill 1)
  other vias: 88.9,87.63
N$86  (via drill 1)
  other vias: 86.36,85.09
N$87  (via drill 1)
  other vias: 88.9,85.09
N$88  (via drill 1)
  other vias: 86.36,82.55
N$89  (via drill 1)
  other vias: 88.9,82.55
N$90  (via drill 1)
  other vias: 91.44,82.55
N$91  (via drill 1)
  other vias: 91.44,85.09
N$92  (via drill 1)
  other vias: 91.44,87.63
N$93  (via drill 1)
  other vias: 91.44,90.17
N$94  (via drill 1)
  other vias: 91.44,92.71
N$95  (via drill 1)
  other vias: 93.98,92.71
N$96  (via drill 1)
  other vias: 93.98,90.17
N$97  (via drill 1)
  other vias: 93.98,87.63
N$98  (via drill 1)
  other vias: 93.98,85.09
N$99  (via drill 1)
  other vias: 93.98,82.55
N$100  (via drill 1)
  other vias: 63.5,77.47
N$101  (via drill 1)
  other vias: 58.42,80.01
N$102
  Top 0.254: T5.1 138.92,81.45 R16.2
N$103  (via drill 1)
  other vias: 58.42,77.47
N$104
  Top 0.254: R17.2 139.53,75.88 T6.1
N$105  (via drill 1)
  other vias: 58.42,74.93
N$106
  Top 0.254: R15.2 139.53,70.8 T7.1
N$107  (via drill 1)
  other vias: 58.42,72.39
N$108
  Top 0.254: LED4.A R18.1
N$109  (via drill 1)
  other vias: 58.42,69.85
N$110  (via drill 1)
  other vias: 63.5,69.85
N$111  (via drill 1)
  other vias: 63.5,72.39
N$112  (via drill 1)
  other vias: 60.96,74.93
N$113  (via drill 1)
  other vias: 60.96,77.47
N$114  (via drill 1)
  other vias: 60.96,80.01
N$115  (via drill 1)
  other vias: 66.04,80.01
N$116  (via drill 1)
  other vias: 68.58,80.01
N$117  (via drill 1)
  other vias: 66.04,77.47
N$118  (via drill 1)
  other vias: 68.58,77.47
N$119  (via drill 1)
  other vias: 66.04,74.93
N$120  (via drill 1)
  other vias: 68.58,74.93
N$121  (via drill 1)
  other vias: 66.04,72.39
N$122  (via drill 1)
  other vias: 68.58,72.39
N$123  (via drill 1)
  other vias: 66.04,69.85
N$124  (via drill 1)
  other vias: 68.58,69.85
N$125  (via drill 1)
  other vias: 71.12,69.85
N$126  (via drill 1)
  other vias: 71.12,72.39
N$127  (via drill 1)
  other vias: 71.12,74.93
N$128  (via drill 1)
  other vias: 71.12,77.47
N$129  (via drill 1)
  other vias: 71.12,80.01
N$130  (via drill 1)
  other vias: 101.6,90.17
N$131  (via drill 1)
  other vias: 101.6,87.63
N$132  (via drill 1)
  other vias: 101.6,85.09
N$133  (via drill 1)
  other vias: 101.6,82.55
N$134  (via drill 1)
  other vias: 101.6,80.01
N$135  (via drill 1)
  other vias: 83.82,77.47
N$136  (via drill 1)
  other vias: 78.74,80.01
N$137  (via drill 1)
  other vias: 76.2,77.47
N$138  (via drill 1)
  other vias: 78.74,77.47
N$139  (via drill 1)
  other vias: 76.2,74.93
N$140  (via drill 1)
  other vias: 78.74,74.93
N$141  (via drill 1)
  other vias: 76.2,72.39
N$142  (via drill 1)
  other vias: 78.74,72.39
N$143  (via drill 1)
  other vias: 76.2,69.85
N$144  (via drill 1)
  other vias: 78.74,69.85
N$145  (via drill 1)
  other vias: 83.82,69.85
N$146  (via drill 1)
  other vias: 83.82,72.39
N$147  (via drill 1)
  other vias: 81.28,74.93
N$148  (via drill 1)
  other vias: 81.28,77.47
N$149  (via drill 1)
  other vias: 81.28,80.01
N$150  (via drill 1)
  other vias: 86.36,80.01
N$151  (via drill 1)
  other vias: 88.9,80.01
N$152  (via drill 1)
  other vias: 86.36,77.47
N$153  (via drill 1)
  other vias: 88.9,77.47
N$154  (via drill 1)
  other vias: 86.36,74.93
N$155  (via drill 1)
  other vias: 88.9,74.93
N$156  (via drill 1)
  other vias: 86.36,72.39
N$157  (via drill 1)
  other vias: 88.9,72.39
N$158  (via drill 1)
  other vias: 86.36,69.85
N$159  (via drill 1)
  other vias: 88.9,69.85
N$160  (via drill 1)
  other vias: 91.44,69.85
N$161  (via drill 1)
  other vias: 91.44,72.39
N$162  (via drill 1)
  other vias: 91.44,74.93
N$163  (via drill 1)
  other vias: 91.44,77.47
N$164  (via drill 1)
  other vias: 91.44,80.01
N$165  (via drill 1)
  other vias: 93.98,80.01
N$166  (via drill 1)
  other vias: 93.98,77.47
N$167  (via drill 1)
  other vias: 93.98,74.93
N$168  (via drill 1)
  other vias: 93.98,72.39
N$169  (via drill 1)
  other vias: 93.98,69.85
N$170  (via drill 1)
  other vias: 101.6,77.47
N$171  (via drill 1)
  other vias: 99.06,92.71
N$172  (via drill 1)
  other vias: 96.52,90.17
N$173  (via drill 1)
  other vias: 99.06,90.17
N$174  (via drill 1)
  other vias: 96.52,87.63
N$175  (via drill 1)
  other vias: 99.06,87.63
N$176  (via drill 1)
  other vias: 96.52,85.09
N$177  (via drill 1)
  other vias: 99.06,85.09
N$178  (via drill 1)
  other vias: 96.52,82.55
N$179  (via drill 1)
  other vias: 99.06,82.55
N$180  (via drill 1)
  other vias: 101.6,74.93
N$181  (via drill 1)
  other vias: 101.6,72.39
N$182  (via drill 1)
  other vias: 101.6,69.85
N$183  (via drill 1)
  other vias: 101.6,67.31
N$184  (via drill 1)
  other vias: 104.14,67.31
N$185  (via drill 1)
  other vias: 104.14,69.85
N$186  (via drill 1)
  other vias: 104.14,72.39
N$187  (via drill 1)
  other vias: 104.14,74.93
N$188  (via drill 1)
  other vias: 104.14,77.47
N$189  (via drill 1)
  other vias: 104.14,80.01
N$190  (via drill 1)
  other vias: 104.14,82.55
N$191  (via drill 1)
  other vias: 104.14,85.09
N$192  (via drill 1)
  other vias: 104.14,87.63
N$193  (via drill 1)
  other vias: 104.14,90.17
N$194  (via drill 1)
  other vias: 104.14,92.71
N$195  (via drill 1)
  other vias: 106.68,92.71
N$196  (via drill 1)
  other vias: 106.68,90.17
N$197  (via drill 1)
  other vias: 106.68,87.63
N$198  (via drill 1)
  other vias: 106.68,85.09
N$199  (via drill 1)
  other vias: 106.68,82.55
N$200  (via drill 1)
  other vias: 106.68,80.01
N$201  (via drill 1)
  other vias: 106.68,77.47
N$202  (via drill 1)
  other vias: 106.68,74.93
N$203  (via drill 1)
  other vias: 106.68,72.39
N$204  (via drill 1)
  other vias: 106.68,69.85
N$205  (via drill 1)
  other vias: 106.68,67.31
N$206  (via drill 1)
  other vias: 109.22,67.31
N$207  (via drill 1)
  other vias: 109.22,69.85
N$208  (via drill 1)
  other vias: 109.22,72.39
N$209  (via drill 1)
  other vias: 109.22,74.93
N$210  (via drill 1)
  other vias: 109.22,77.47
N$211  (via drill 1)
  other vias: 109.22,80.01
N$212  (via drill 1)
  other vias: 109.22,82.55
N$213  (via drill 1)
  other vias: 109.22,85.09
N$214  (via drill 1)
  other vias: 109.22,87.63
N$215  (via drill 1)
  other vias: 109.22,90.17
N$216  (via drill 1)
  other vias: 109.22,92.71
N$217  (via drill 1)
  other vias: 111.76,92.71
N$218  (via drill 1)
  other vias: 111.76,90.17
N$219  (via drill 1)
  other vias: 111.76,87.63
N$220  (via drill 1)
  other vias: 111.76,85.09
N$221  (via drill 1)
  other vias: 111.76,82.55
N$222  (via drill 1)
  other vias: 111.76,80.01
N$223  (via drill 1)
  other vias: 111.76,77.47
N$224  (via drill 1)
  other vias: 111.76,74.93
N$225  (via drill 1)
  other vias: 111.76,72.39
N$226  (via drill 1)
  other vias: 111.76,69.85
N$227  (via drill 1)
  other vias: 111.76,67.31
N$228  (via drill 1)
  other vias: 114.3,67.31
N$229  (via drill 1)
  other vias: 114.3,69.85
N$230  (via drill 1)
  other vias: 114.3,72.39
N$231  (via drill 1)
  other vias: 114.3,74.93
N$232  (via drill 1)
  other vias: 114.3,77.47
N$233  (via drill 1)
  other vias: 114.3,80.01
N$234  (via drill 1)
  other vias: 114.3,82.55
N$235  (via drill 1)
  other vias: 114.3,85.09
N$236  (via drill 1)
  other vias: 114.3,87.63
N$237  (via drill 1)
  other vias: 114.3,90.17
N$238  (via drill 1)
  other vias: 114.3,92.71
N$239  (via drill 1)
  other vias: 116.84,92.71
N$240  (via drill 1)
  other vias: 116.84,90.17
N$241  (via drill 1)
  other vias: 99.06,80.01
N$242  (via drill 1)
  other vias: 96.52,77.47
N$243  (via drill 1)
  other vias: 99.06,77.47
N$244  (via drill 1)
  other vias: 96.52,74.93
N$245  (via drill 1)
  other vias: 99.06,74.93
N$246  (via drill 1)
  other vias: 96.52,72.39
N$247  (via drill 1)
  other vias: 99.06,72.39
N$248  (via drill 1)
  other vias: 96.52,69.85
N$249  (via drill 1)
  other vias: 99.06,69.85
N$250  (via drill 1)
  other vias: 116.84,87.63
N$251  (via drill 1)
  other vias: 116.84,85.09
N$252  (via drill 1)
  other vias: 116.84,82.55
N$253  (via drill 1)
  other vias: 116.84,80.01
N$254  (via drill 1)
  other vias: 116.84,77.47
N$255  (via drill 1)
  other vias: 116.84,74.93
N$256  (via drill 1)
  other vias: 116.84,72.39
N$257  (via drill 1)
  other vias: 116.84,69.85
N$258  (via drill 1)
  other vias: 116.84,67.31
N$259  (via drill 1)
  other vias: 119.38,67.31
N$260  (via drill 1)
  other vias: 119.38,69.85
N$261  (via drill 1)
  other vias: 119.38,72.39
N$262  (via drill 1)
  other vias: 119.38,74.93
N$263  (via drill 1)
  other vias: 119.38,77.47
N$264  (via drill 1)
  other vias: 119.38,80.01
N$265  (via drill 1)
  other vias: 119.38,82.55
N$266  (via drill 1)
  other vias: 119.38,85.09
N$267  (via drill 1)
  other vias: 119.38,87.63
N$268  (via drill 1)
  other vias: 119.38,90.17
N$269  (via drill 1)
  other vias: 119.38,92.71
N$270  (via drill 1)
  other vias: 121.92,92.71
N$271  (via drill 1)
  other vias: 121.92,90.17
N$272  (via drill 1)
  other vias: 121.92,87.63
N$273  (via drill 1)
  other vias: 121.92,85.09
N$274  (via drill 1)
  other vias: 121.92,82.55
N$275  (via drill 1)
  other vias: 121.92,80.01
N$276  (via drill 1)
  other vias: 121.92,77.47
N$277  (via drill 1)
  other vias: 121.92,74.93
N$278  (via drill 1)
  other vias: 121.92,72.39
N$279  (via drill 1)
  other vias: 121.92,69.85
N$280  (via drill 1)
  other vias: 121.92,67.31
N$281  (via drill 1)
  other vias: 124.46,67.31
N$282  (via drill 1)
  other vias: 124.46,69.85
N$283  (via drill 1)
  other vias: 124.46,72.39
N$284  (via drill 1)
  other vias: 127,67.31
N$285  (via drill 1)
  other vias: 129.54,67.31
N$286  (via drill 1)
  other vias: 132.08,67.31
N$287  (via drill 1)
  other vias: 132.08,69.85
N$288  (via drill 1)
  other vias: 129.54,69.85
N$289  (via drill 1)
  other vias: 127,69.85
N$290  (via drill 1)
  other vias: 127,72.39
N$291  (via drill 1)
  other vias: 129.54,72.39
N$292  (via drill 1)
  other vias: 132.08,72.39
N$293  (via drill 1)
  other vias: 132.08,74.93
N$294  (via drill 1)
  other vias: 129.54,74.93
N$295  (via drill 1)
  other vias: 127,74.93
N$296  (via drill 1)
  other vias: 124.46,74.93
N$297  (via drill 1)
  other vias: 124.46,77.47
N$298  (via drill 1)
  other vias: 127,77.47
N$299  (via drill 1)
  other vias: 129.54,77.47
N$300  (via drill 1)
  other vias: 132.08,77.47
N$301  (via drill 1)
  other vias: 132.08,80.01
N$302  (via drill 1)
  other vias: 129.54,80.01
N$303  (via drill 1)
  other vias: 127,80.01
N$304  (via drill 1)
  other vias: 124.46,80.01
N$305  (via drill 1)
  other vias: 124.46,82.55
N$306  (via drill 1)
  other vias: 127,82.55
N$307  (via drill 1)
  other vias: 129.54,82.55
N$308  (via drill 1)
  other vias: 132.08,82.55
N$309  (via drill 1)
  other vias: 132.08,85.09
N$310
  Top 0.254: R19.1 LED3.A
N$311  (via drill 1)
  other vias: 58.42,67.31
N$312  (via drill 1)
  other vias: 129.54,85.09
N$313  (via drill 1)
  other vias: 127,85.09
N$314  (via drill 1)
  other vias: 124.46,85.09
N$315  (via drill 1)
  other vias: 63.5,67.31
N$316  (via drill 1)
  other vias: 66.04,67.31
N$317  (via drill 1)
  other vias: 68.58,67.31
N$318  (via drill 1)
  other vias: 124.46,87.63
N$319  (via drill 1)
  other vias: 127,87.63
N$320  (via drill 1)
  other vias: 129.54,87.63
N$321  (via drill 1)
  other vias: 71.12,67.31
N$322  (via drill 1)
  other vias: 132.08,87.63
N$323  (via drill 1)
  other vias: 132.08,90.17
N$324  (via drill 1)
  other vias: 76.2,67.31
N$325  (via drill 1)
  other vias: 78.74,67.31
N$326  (via drill 1)
  other vias: 129.54,90.17
N$327  (via drill 1)
  other vias: 127,90.17
N$328  (via drill 1)
  other vias: 124.46,90.17
N$329  (via drill 1)
  other vias: 83.82,67.31
N$330  (via drill 1)
  other vias: 86.36,67.31
N$331  (via drill 1)
  other vias: 88.9,67.31
N$332  (via drill 1)
  other vias: 124.46,92.71
N$333  (via drill 1)
  other vias: 127,92.71
N$334  (via drill 1)
  other vias: 129.54,92.71
N$335  (via drill 1)
  other vias: 91.44,67.31
N$336  (via drill 1)
  other vias: 93.98,67.31
N$337  (via drill 1)
  other vias: 132.08,92.71
N$338  (via drill 1)
  other vias: 96.52,67.31
N$339  (via drill 1)
  other vias: 99.06,67.31
N$366  (via drill 1)
  other vias: 45.72,90.17
N$367  (via drill 1)
  other vias: 40.64,92.71
N$368  (via drill 1)
  other vias: 38.1,90.17
N$369  (via drill 1)
  other vias: 40.64,90.17
N$370  (via drill 1)
  other vias: 38.1,87.63
N$371  (via drill 1)
  other vias: 40.64,87.63
N$372  (via drill 1)
  other vias: 38.1,85.09
N$373  (via drill 1)
  other vias: 40.64,85.09
N$374  (via drill 1)
  other vias: 38.1,82.55
N$375  (via drill 1)
  other vias: 40.64,82.55
N$376  (via drill 1)
  other vias: 45.72,82.55
N$377  (via drill 1)
  other vias: 45.72,85.09
N$378  (via drill 1)
  other vias: 43.18,87.63
N$379  (via drill 1)
  other vias: 43.18,90.17
N$380  (via drill 1)
  other vias: 43.18,92.71
N$381  (via drill 1)
  other vias: 48.26,92.71
N$382  (via drill 1)
  other vias: 50.8,92.71
N$383  (via drill 1)
  other vias: 48.26,90.17
N$384  (via drill 1)
  other vias: 50.8,90.17
N$385  (via drill 1)
  other vias: 48.26,87.63
N$386  (via drill 1)
  other vias: 50.8,87.63
N$387  (via drill 1)
  other vias: 48.26,85.09
N$388  (via drill 1)
  other vias: 50.8,85.09
N$389  (via drill 1)
  other vias: 48.26,82.55
N$390  (via drill 1)
  other vias: 50.8,82.55
N$391  (via drill 1)
  other vias: 53.34,82.55
N$392  (via drill 1)
  other vias: 53.34,85.09
N$393  (via drill 1)
  other vias: 53.34,87.63
N$394  (via drill 1)
  other vias: 53.34,90.17
N$395  (via drill 1)
  other vias: 53.34,92.71
N$396  (via drill 1)
  other vias: 45.72,77.47
N$397  (via drill 1)
  other vias: 40.64,80.01
N$398  (via drill 1)
  other vias: 38.1,77.47
N$399  (via drill 1)
  other vias: 40.64,77.47
N$400  (via drill 1)
  other vias: 38.1,74.93
N$401  (via drill 1)
  other vias: 40.64,74.93
N$402  (via drill 1)
  other vias: 38.1,72.39
N$403  (via drill 1)
  other vias: 40.64,72.39
N$404  (via drill 1)
  other vias: 38.1,69.85
N$405  (via drill 1)
  other vias: 40.64,69.85
N$406  (via drill 1)
  other vias: 45.72,69.85
N$407  (via drill 1)
  other vias: 45.72,72.39
N$408  (via drill 1)
  other vias: 43.18,74.93
N$409  (via drill 1)
  other vias: 43.18,77.47
N$410  (via drill 1)
  other vias: 43.18,80.01
N$411  (via drill 1)
  other vias: 48.26,80.01
N$412  (via drill 1)
  other vias: 50.8,80.01
N$413  (via drill 1)
  other vias: 48.26,77.47
N$414  (via drill 1)
  other vias: 50.8,77.47
N$415  (via drill 1)
  other vias: 48.26,74.93
N$416  (via drill 1)
  other vias: 50.8,74.93
N$417  (via drill 1)
  other vias: 48.26,72.39
N$418  (via drill 1)
  other vias: 50.8,72.39
N$419  (via drill 1)
  other vias: 48.26,69.85
N$420  (via drill 1)
  other vias: 50.8,69.85
N$421  (via drill 1)
  other vias: 53.34,69.85
N$422  (via drill 1)
  other vias: 53.34,72.39
N$423  (via drill 1)
  other vias: 53.34,74.93
N$424  (via drill 1)
  other vias: 53.34,77.47
N$425  (via drill 1)
  other vias: 53.34,80.01
N$426  (via drill 1)
  other vias: 38.1,67.31
N$427  (via drill 1)
  other vias: 40.64,67.31
N$431  (via drill 1)
  other vias: 45.72,67.31
N$432  (via drill 1)
  other vias: 48.26,67.31
N$433  (via drill 1)
  other vias: 50.8,67.31
N$437  (via drill 1)
  other vias: 53.34,67.31
N$438  (via drill 1)
  other vias: 27.94,90.17
N$439  (via drill 1)
  other vias: 22.86,92.71
N$440  (via drill 1)
  other vias: 20.32,90.17
N$441  (via drill 1)
  other vias: 22.86,90.17
N$442  (via drill 1)
  other vias: 20.32,87.63
N$443  (via drill 1)
  other vias: 22.86,87.63
N$444  (via drill 1)
  other vias: 20.32,85.09
N$445  (via drill 1)
  other vias: 22.86,85.09
N$446  (via drill 1)
  other vias: 20.32,82.55
N$447  (via drill 1)
  other vias: 22.86,82.55
N$448  (via drill 1)
  other vias: 27.94,92.71
N$449  (via drill 1)
  other vias: 27.94,85.09
N$450  (via drill 1)
  other vias: 25.4,87.63
N$451  (via drill 1)
  other vias: 25.4,90.17
N$452  (via drill 1)
  other vias: 25.4,92.71
N$453  (via drill 1)
  other vias: 30.48,92.71
N$454  (via drill 1)
  other vias: 33.02,92.71
N$455  (via drill 1)
  other vias: 30.48,90.17
N$456  (via drill 1)
  other vias: 33.02,90.17
N$457  (via drill 1)
  other vias: 30.48,87.63
N$458  (via drill 1)
  other vias: 33.02,87.63
N$459  (via drill 1)
  other vias: 30.48,85.09
N$460  (via drill 1)
  other vias: 33.02,85.09
N$461  (via drill 1)
  other vias: 30.48,82.55
N$462  (via drill 1)
  other vias: 33.02,82.55
N$463  (via drill 1)
  other vias: 35.56,82.55
N$464  (via drill 1)
  other vias: 35.56,85.09
N$465  (via drill 1)
  other vias: 35.56,87.63
N$466  (via drill 1)
  other vias: 35.56,90.17
N$467  (via drill 1)
  other vias: 35.56,92.71
N$468  (via drill 1)
  other vias: 27.94,77.47
N$469  (via drill 1)
  other vias: 22.86,80.01
N$470  (via drill 1)
  other vias: 20.32,77.47
N$471  (via drill 1)
  other vias: 22.86,77.47
N$472  (via drill 1)
  other vias: 20.32,74.93
N$473  (via drill 1)
  other vias: 22.86,74.93
N$474  (via drill 1)
  other vias: 20.32,72.39
N$475  (via drill 1)
  other vias: 22.86,72.39
N$476  (via drill 1)
  other vias: 20.32,69.85
N$477  (via drill 1)
  other vias: 22.86,69.85
N$478  (via drill 1)
  other vias: 27.94,80.01
N$479  (via drill 1)
  other vias: 27.94,72.39
N$480  (via drill 1)
  other vias: 25.4,74.93
N$481  (via drill 1)
  other vias: 25.4,77.47
N$482  (via drill 1)
  other vias: 25.4,80.01
N$483  (via drill 1)
  other vias: 30.48,80.01
N$484  (via drill 1)
  other vias: 33.02,80.01
N$485  (via drill 1)
  other vias: 30.48,77.47
N$486  (via drill 1)
  other vias: 33.02,77.47
N$487  (via drill 1)
  other vias: 30.48,74.93
N$488  (via drill 1)
  other vias: 33.02,74.93
N$489  (via drill 1)
  other vias: 30.48,72.39
N$490  (via drill 1)
  other vias: 33.02,72.39
N$491  (via drill 1)
  other vias: 30.48,69.85
N$492  (via drill 1)
  other vias: 33.02,69.85
N$493  (via drill 1)
  other vias: 35.56,69.85
N$494  (via drill 1)
  other vias: 35.56,72.39
N$495  (via drill 1)
  other vias: 35.56,74.93
N$496  (via drill 1)
  other vias: 35.56,77.47
N$497  (via drill 1)
  other vias: 35.56,80.01
N$498  (via drill 1)
  other vias: 20.32,67.31
N$499  (via drill 1)
  other vias: 22.86,67.31
N$503  (via drill 1)
  other vias: 27.94,67.31
N$504  (via drill 1)
  other vias: 30.48,67.31
N$505  (via drill 1)
  other vias: 33.02,67.31
N$509  (via drill 1)
  other vias: 35.56,67.31
N$510  (via drill 1)
  other vias: 20.32,92.71
N$511  (via drill 1)
  other vias: 12.7,92.71
N$513  (via drill 1)
  other vias: 12.7,90.17
N$515  (via drill 1)
  other vias: 12.7,87.63
N$517  (via drill 1)
  other vias: 12.7,85.09
N$519  (via drill 1)
  other vias: 12.7,82.55
N$520  (via drill 1)
  other vias: 17.78,82.55
N$521  (via drill 1)
  other vias: 17.78,85.09
N$522  (via drill 1)
  other vias: 15.24,87.63
N$523  (via drill 1)
  other vias: 15.24,90.17
N$524  (via drill 1)
  other vias: 15.24,92.71
N$525  (via drill 1)
  other vias: 17.78,87.63
N$526  (via drill 1)
  other vias: 17.78,77.47
N$527  (via drill 1)
  other vias: 12.7,80.01
N$529  (via drill 1)
  other vias: 12.7,77.47
N$531  (via drill 1)
  other vias: 12.7,74.93
N$533  (via drill 1)
  other vias: 12.7,72.39
N$535  (via drill 1)
  other vias: 12.7,69.85
N$536  (via drill 1)
  other vias: 17.78,69.85
N$537  (via drill 1)
  other vias: 17.78,72.39
N$538  (via drill 1)
  other vias: 15.24,74.93
N$539  (via drill 1)
  other vias: 15.24,77.47
N$540  (via drill 1)
  other vias: 15.24,80.01
N$541  (via drill 1)
  other vias: 17.78,74.93
N$543  (via drill 1)
  other vias: 12.7,67.31
N$547  (via drill 1)
  other vias: 17.78,67.31
N$548  (via drill 1)
  other vias: 17.78,92.71
N$549  (via drill 1)
  other vias: 15.24,82.55
N$550  (via drill 1)
  other vias: 15.24,85.09
N$552  (via drill 1)
  other vias: 17.78,90.17
N$554  (via drill 1)
  other vias: 20.32,80.01
N$555  (via drill 1)
  other vias: 17.78,80.01
N$556  (via drill 1)
  other vias: 15.24,72.39
N$557  (via drill 1)
  other vias: 15.24,69.85
N$558  (via drill 1)
  other vias: 15.24,67.31
N$561  (via drill 1)
  other vias: 25.4,67.31
N$562  (via drill 1)
  other vias: 25.4,69.85
N$563  (via drill 1)
  other vias: 27.94,69.85
N$564  (via drill 1)
  other vias: 25.4,72.39
N$565  (via drill 1)
  other vias: 27.94,74.93
N$566  (via drill 1)
  other vias: 25.4,82.55
N$567  (via drill 1)
  other vias: 25.4,85.09
N$568  (via drill 1)
  other vias: 27.94,82.55
N$569  (via drill 1)
  other vias: 27.94,87.63
N$570  (via drill 1)
  other vias: 38.1,92.71
N$571  (via drill 1)
  other vias: 45.72,92.71
N$572  (via drill 1)
  other vias: 45.72,87.63
N$573  (via drill 1)
  other vias: 43.18,85.09
N$574  (via drill 1)
  other vias: 43.18,82.55
N$575  (via drill 1)
  other vias: 38.1,80.01
N$576  (via drill 1)
  other vias: 45.72,80.01
N$577  (via drill 1)
  other vias: 45.72,74.93
N$578  (via drill 1)
  other vias: 43.18,72.39
N$579  (via drill 1)
  other vias: 43.18,69.85
N$580  (via drill 1)
  other vias: 43.18,67.31
N$583  (via drill 1)
  other vias: 63.5,92.71
N$584  (via drill 1)
  other vias: 63.5,87.63
N$585  (via drill 1)
  other vias: 60.96,85.09
N$586  (via drill 1)
  other vias: 60.96,82.55
N$587  (via drill 1)
  other vias: 63.5,80.01
N$589  (via drill 1)
  other vias: 63.5,74.93
N$590  (via drill 1)
  other vias: 60.96,72.39
N$591  (via drill 1)
  other vias: 60.96,69.85
N$592  (via drill 1)
  other vias: 60.96,67.31
N$594  (via drill 1)
  other vias: 76.2,80.01
N$595  (via drill 1)
  other vias: 83.82,80.01
N$596  (via drill 1)
  other vias: 83.82,74.93
N$597  (via drill 1)
  other vias: 81.28,72.39
N$598  (via drill 1)
  other vias: 81.28,69.85
N$599  (via drill 1)
  other vias: 81.28,67.31
N$601  (via drill 1)
  other vias: 81.28,82.55
N$602  (via drill 1)
  other vias: 81.28,85.09
N$603  (via drill 1)
  other vias: 83.82,82.55
N$604  (via drill 1)
  other vias: 83.82,87.63
N$605  (via drill 1)
  other vias: 76.2,92.71
N$606  (via drill 1)
  other vias: 96.52,92.71
N$607  (via drill 1)
  other vias: 96.52,80.01
PB1  (via drill 0.3, 1)
  Top 0.254: IC1.13 36.2,30.55 v36.2,31.11
  Bottom 0.254: v36.2,31.11 36.2,33.02 33.02,36.2 33.02,38.1 37.47,42.55 37.47,60.96 34.92,63.5 33.02,63.5 v31.75,64.77
PC3  (via drill 0.3, 1)
  Top 0.254: IC1.26 v44.74,36.83
  Bottom 0.254: v44.74,36.83 44.74,37.81 42.55,40.01 42.55,60.96 43.81,62.23 49.53,62.23 v52.07,64.77
PC4  (via drill 0.3, 1)
  Top 0.254: IC1.27 v43.61,36.83
  Bottom 0.254: v43.61,36.83 43.61,38.31 41.91,40.01 41.91,60.96 43.81,62.87 47.62,62.87 v49.53,64.77
PC5  (via drill 0.3, 1)
  Top 0.254: IC1.28 v42.48,36.83
  Bottom 0.254: v42.48,36.83 42.48,38.8 41.27,40.01 41.27,60.96 43.81,63.5 45.72,63.5 v46.99,64.77
PD2  (via drill 0.3, 1)
  Top 0.254: IC1.32 v40.01,38.88
  Bottom 0.254: v40.01,38.88 40.64,39.52 40.64,60.96 v44.45,64.77
PD3  (via drill 0.3, 1)
  Top 0.254: IC1.1 37.47,38.46 v37.47,39.52
  Bottom 0.254: v41.91,64.77 40.01,62.87 40.01,42.06 v37.47,39.52
PD4  (via drill 0.3, 1)
  Top 0.254: IC1.2 35.88,38.07 v35.88,38.71
  Bottom 0.254: v39.37,64.77 39.37,42.52 36.51,39.69 35.88,39.05 v35.88,38.71
PD6  (via drill 0.3, 1)
  Top 0.254: v32.38,30.13 IC1.10
  Bottom 0.254: v26.67,64.77 29.21,62.23 34.92,62.23 36.2,60.96 36.2,42.55 31.75,38.1 31.75,36.2 32.38,35.56 v32.38,30.13
PD7  (via drill 0.3, 1)
  Top 0.254: IC1.11 34.92,31.54 v34.92,32.38
  Bottom 0.254: v34.92,32.38 34.92,33.66 32.38,36.2 32.38,38.1 36.83,42.55 36.83,60.96 34.92,62.87 31.11,62.87 v29.21,64.77
PRE12V  (via drill 0.5)
  Top 0.406: SJ1.3 93.34,33.02 93.98,32.38 v93.98,28.57
  Top 0.813: D2.P$3 98.42,26.67 v99.06,26.67
  Top 1.422: v96.52,24.77 95.89,24.13 IC2.3
  Bottom 1.422: IC2.3 95.89,24.13 v96.52,24.77
  other vias: 96.52,22.86 99.06,22.86 101.6,22.86 93.98,24.77 93.98,26.67 96.52,28.57 96.52,26.67 99.06,24.77 99.06,28.57 101.6,28.57 101.6,26.67 101.6,24.77 93.98,22.86
  pour Bottom: 92.08,30.48 103.5,30.48 103.5,21.59 92.08,21.59
RESET  (via drill 0.3)
  Top 0.254: v18.41,24.77 18.41,27.94 20.95,30.48 IC8.17
  Bottom 0.254: ISP.5 17.78,7.62 17.78,24.13 v18.41,24.77
RST
  Top 0.254: R1.1 45.1,39.95 | IC1.29 43.21,38.7
  Top 0.406: 45.1,39.95 C13.2 | 43.21,38.7 R1.1
RXCAN  (via drill 0.3)
  Top 0.254: v6.99,12.06 IC9.4 | v14.61,30.48 IC8.2
  Bottom 0.254: v6.99,12.06 6.99,15.88 7.62,16.51 9.53,16.51 15.24,22.23 15.24,29.84 v14.61,30.48
RXD  (via drill 0.3)
  Top 0.254: v38.3,34.92 IC1.30
  Top 0.406: v60.96,22.23 IC7.12
  Bottom 0.254: v60.96,22.23 59.69,23.5 50.16,23.5 38.74,34.92 v38.3,34.92
SCK  (via drill 0.3)
  Top 0.254: v20.32,25.4 IC8.13 | 23.5,25.4 25.4,27.3 34.92,27.3 35.56,26.67 37.47,26.67 38.8,28 IC1.17
  Top 0.406: IC8.13 23.5,25.4
  Bottom 0.254: ISP.7 17.14,9.53 17.14,24.77 17.78,25.4 v20.32,25.4
SPEAKER  (via drill 0.3)
  Top 0.254: IC1.14 36.83,30.05 36.83,30.48 39.37,33.02 v47.62,33.02 | v57.15,34.29 58.42,35.56 R5.1
  Bottom 0.254: v47.62,33.02 55.88,33.02 v57.15,34.29
SW_GELB
  Bottom 0.254: IC11.2 124.46,38.1 125.09,38.73 125.09,60.96 126.36,62.23 145.41,62.23 149.86,66.67 149.86,76.2 SV2.6
SW_GRUEN
  Top 0.254: IC13.2 149.86,50.16 150.5,50.8 150.5,73.03 SV2.8
SW_ROT
  Bottom 0.254: SV2.4 147.32,78.74 147.32,64.77 145.41,62.87 115.57,62.87 114.94,62.23 114.94,34.92 105.41,25.4 105.41,20.32 104.14,19.05 92.01,19.05 IC2.2
SYS12V
  Top 0.254: 105.41,25.4 114.94,34.92 114.94,62.23 115.57,62.87 135.89,62.87 136.53,63.5 136.53,78.74 136.84,79.06 R16.1
  Top 0.406: IC2.1 85.8,19.05 | IC2.5 85.78,32.44 86.36,33.02 SJ1.1
  Top 0.813: 85.8,19.05 104.14,19.05 105.41,20.32 105.41,25.4 105.41,30.48 101.19,34.7 F1-3A.P$1
  Top 1.422: IC2.5 84.47,29.23 81.92,26.67 81.92,21.59 84.47,19.03 IC2.1 89.53,15.28 X2.L5
  Bottom 1.422: X2.L5 89.53,15.28 IC2.1 84.45,19.05 81.92,21.59 81.92,26.67 84.45,29.21 IC2.5
SYS24V  (via drill 0.5)  (1 unrouted)
  Top 0.254: R17.1 137.16,72.71 137.16,63.5 135.89,62.23 116.84,62.23 115.57,60.96 117.47,60.96 v118.11,60.33
  Top 0.406: IC11.1 v118.11,46.99 123.83,46.99 IC13.6
  other vias: 120.65,60.33 118.11,58.42 120.65,58.42 123.19,58.42 123.19,56.52 118.11,56.52 120.65,56.52 123.19,48.9 120.65,48.9 123.19,50.8 123.19,54.61 118.11,48.9 120.65,46.99 123.19,46.99 120.65,45.09 118.11,45.09 123.19,45.09 116.2,56.52 116.2,48.9 116.2,45.09 116.2,52.7 116.2,58.42 116.2,54.61 116.2,50.8 116.2,46.99 116.2,60.33 123.19,60.33
  pour Bottom: 124.46,61.59 115.57,61.59 115.57,5.08 121.92,5.08 121.92,26.67 124.46,26.67
  pour Top: 124.46,61.59 115.57,61.59 115.57,5.08 121.92,5.08 121.92,26.67 124.46,26.67
TXCAN  (via drill 0.3)
  Top 0.254: IC9.1 v10.16,15.88 | v15.24,31.75 IC8.1
  Bottom 0.254: v10.16,15.88 10.16,16.51 15.88,22.23 15.88,31.11 v15.24,31.75
TXD  (via drill 0.3)
  Top 0.254: v38.45,36.2 IC1.31
  Top 0.406: v61.06,24.77 IC7.10
  Bottom 0.254: v61.06,24.77 60.33,24.77 59.69,24.13 50.52,24.13 v38.45,36.2
VDD  (via drill 0.3, 1)
  Top 0.254: 61.2,17.14 IC7.16 | IC8.4 IC8.5 IC8.6 15.24,25.4 | 55.31,56.58 58.42,53.47 58.42,47.62 55.88,45.09 | IC1.6 33.04,36.39 | C5.1 34.84,36.85 IC1.4 | 6.57,13.34 IC9.3 | IC8.10 19.05,21.59 18.63,21.17 | 18.63,21.17 C17.2 16.73,17.78 11.43,17.78 11.43,13.97 10.79,13.34 | 15.24,25.4 21.59,31.75 IC8.18 23.5,31.75 24.77,30.48 30.48,30.48 33.02,33.02 33.66,33.02 35.03,34.39 | 9.53,13.34 10.79,13.34 | 10.79,13.34 11.43,12.7 11.43,10.16 17.78,10.16 19.05,8.89 19.05,3.81 ISP.2 | SJ3.1 54.98,16.91 C25.1 | 48.9,22.99 48.9,23.5 48.26,24.13 46.99,24.13 | IC1.6 33.02,36.4 | C4.+ 49.67,45.09 IC3.3 | 35.03,34.39 IC1.6 | 35.03,34.39 35.13,34.29 36.2,34.29 37.47,35.56 37.47,36.83 38.1,37.47 38.1,38.1 40.64,40.64 41.91,40.64 R1.2 43.76,41.29 | 15.24,25.4 15.24,24.56 18.63,21.17 | 42.55,24.77 41.91,24.13 32.51,24.13 SJ2.1 | L1.2 43.18,24.13 46.99,24.13 | v55.88,92.71 v55.88,90.17 v55.88,87.63 v55.88,85.09 v55.88,82.55 v55.88,80.01 v55.88,77.47 v55.88,74.93 v55.88,72.39 v55.88,69.85 v55.88,67.31 55.88,60.96 | 55.88,57.15 55.88,60.96 | v46.99,45.09 46.99,45.23 C4.+ | v46.99,29.21 46.99,24.13 | C4.+ 45.86,46.49 43.18,43.81 43.18,41.94 C12.2 | 55.88,60.96 R19.2
  Top 0.406: C25.1 61.2,17.14 | L2.P$2 55.31,56.58 55.88,57.15 | IC3.3 55.88,45.09 | 33.04,36.39 C5.1 | C24.2 6.57,13.34 | IC9.3 9.53,13.34 | 48.9,22.99 SJ3.1 | L1.2 42.55,24.77 | 42.55,24.77 | 43.76,41.29 C12.2 | R1.2
  Bottom 0.254: v55.88,67.31 v55.88,69.85 v55.88,72.39 v55.88,74.93 v55.88,77.47 v55.88,80.01 v55.88,82.55 v55.88,85.09 v55.88,87.63 v55.88,90.17 v55.88,92.71 | v46.99,45.09 v46.99,29.21

## Text on the board
tPlace: Digital | Analog | Leds | SchalterBox | Digital Supply | Analog Supply | 5V-3A | PD6 | PD7 | PB1 | ADC6 | ADC7 | PD4 | PD3 | PD2 | PC5 | PC4 | PC3 | 5V | 500mA | Motion | MCU | Atmega168 | 12V | 24V | CAN | RS232 | BAT | EXT | 12V
tNames: CN2013 | PowerSwitch-009
Document: ADCs | Speaker